# EAGLE design Esp32_Base_Shield (EAGLE 9.1.3)
ESP Devkit-C Shield
CNAME: ESP32-DEVKIT SHIELD DESIGN; CREVISION: 1.0; DESIGNER: EREN MERT IREZ
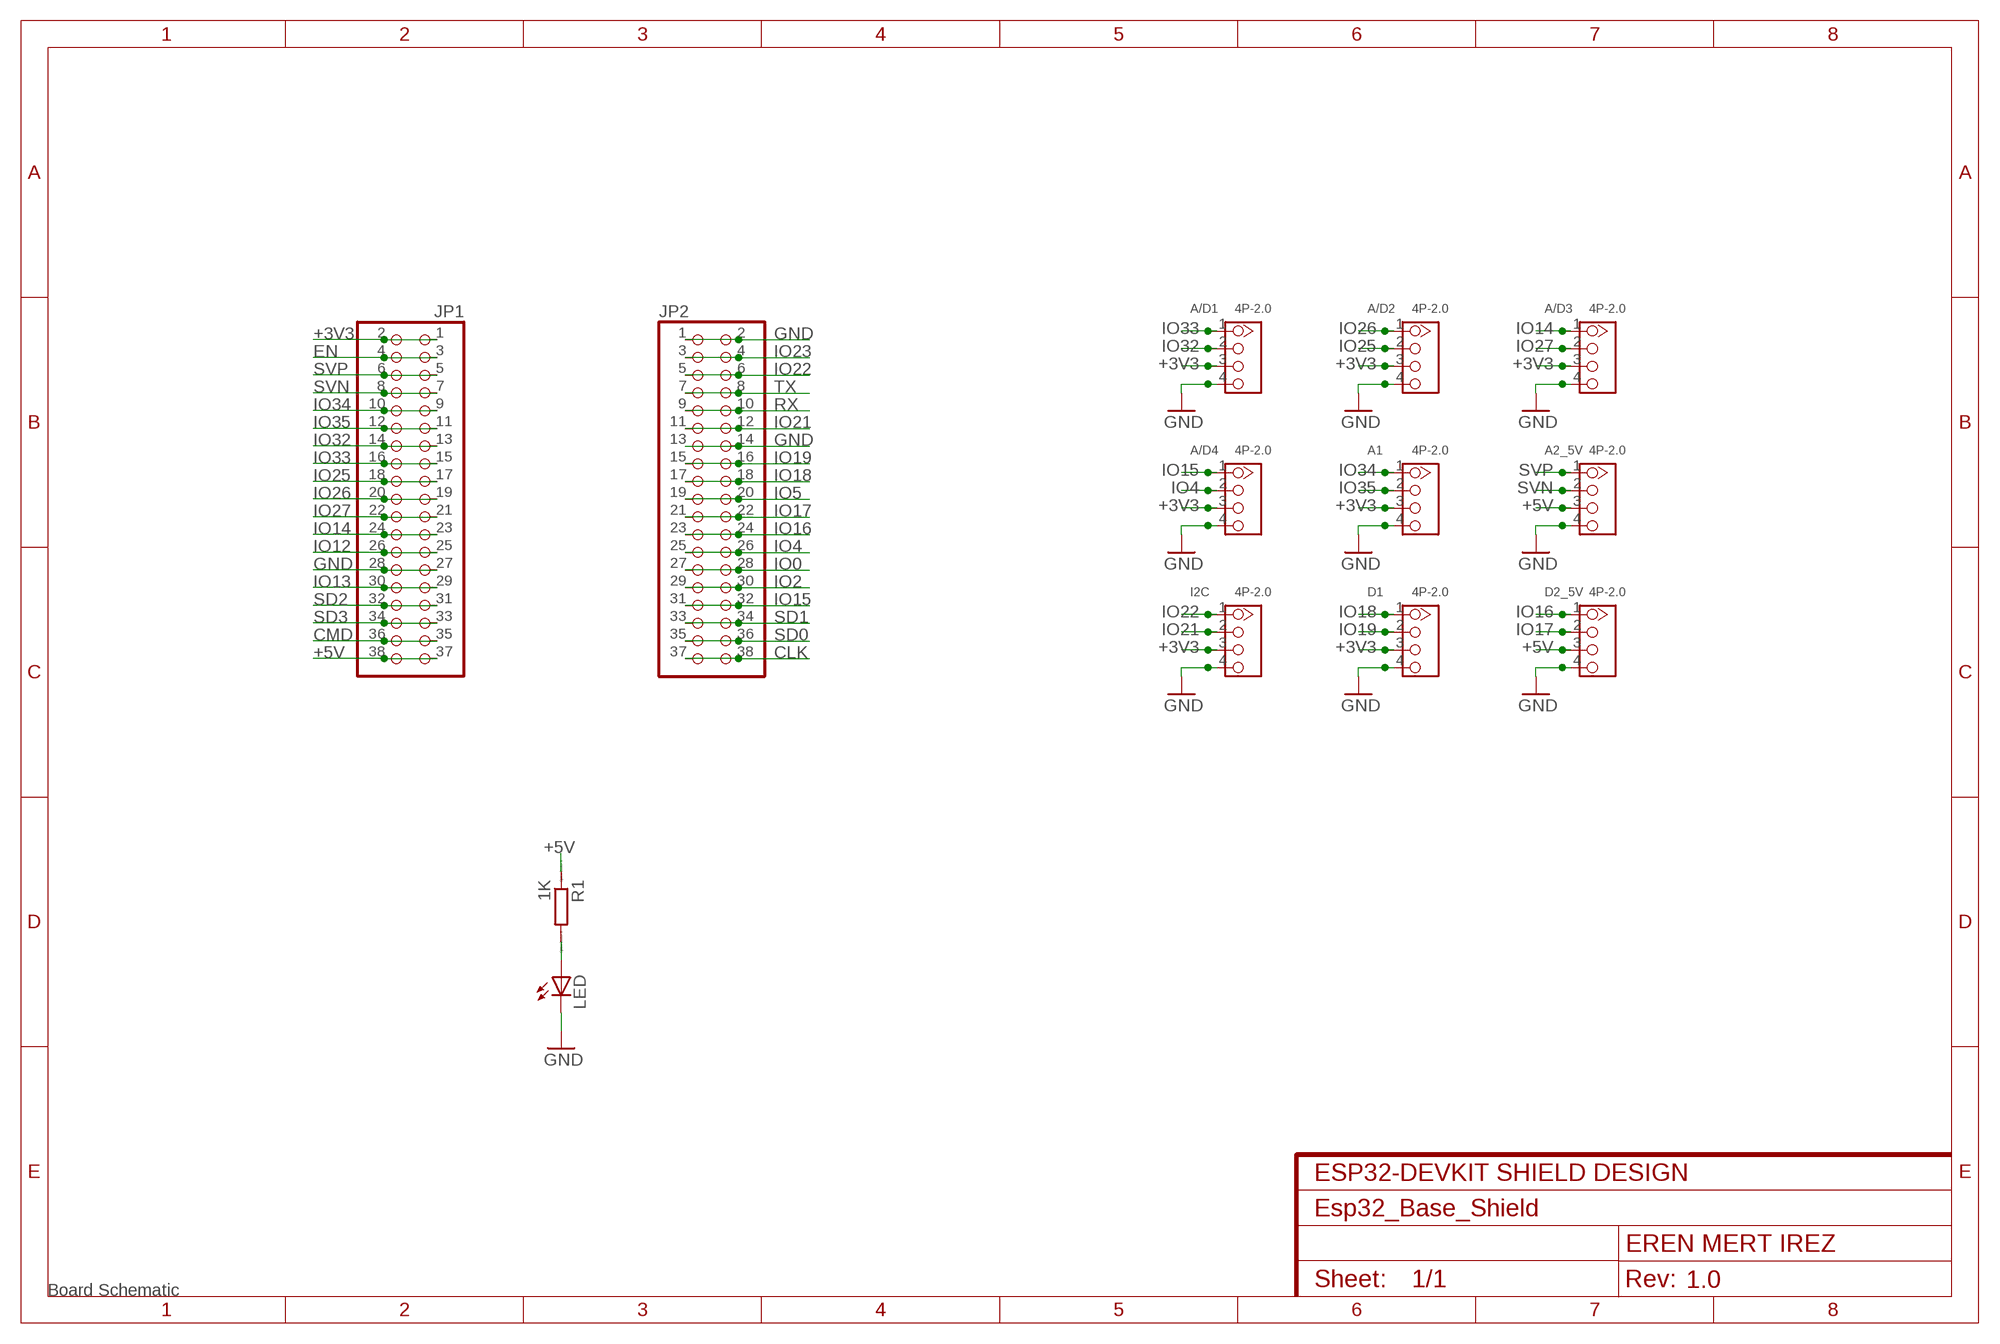
[diagram p0: schematic, sheet 1]
FRAME1 (FRAME-A4L): UNTITLED: Board Schematic

## Parts
A1  4P-2.0  GROVE-CONNECTOR-DIP(4P-2.0)  [HW4-2.0]
A2_5V  4P-2.0  GROVE-CONNECTOR-DIP(4P-2.0)  [HW4-2.0]
A/D1  4P-2.0  GROVE-CONNECTOR-DIP(4P-2.0)  [HW4-2.0]
A/D2  4P-2.0  GROVE-CONNECTOR-DIP(4P-2.0)  [HW4-2.0]
A/D3  4P-2.0  GROVE-CONNECTOR-DIP(4P-2.0)  [HW4-2.0]
A/D4  4P-2.0  GROVE-CONNECTOR-DIP(4P-2.0)  [HW4-2.0]
D1  4P-2.0  GROVE-CONNECTOR-DIP(4P-2.0)  [HW4-2.0]
D2_5V  4P-2.0  GROVE-CONNECTOR-DIP(4P-2.0)  [HW4-2.0]
I2C  4P-2.0  GROVE-CONNECTOR-DIP(4P-2.0)  [HW4-2.0]
JP1  PINHD-2X19  [2X19]
JP2  PINHD-2X19  [2X19]
LED  LED3MM  [LED3MM]
R1  1K  R0207/10  [0207/10]

## Nets
+3V3: A1.3 A/D1.3 A/D2.3 A/D3.3 A/D4.3 D1.3 I2C.3 JP1.1 JP1.2
+5V: A2_5V.3 D2_5V.3 JP1.37 JP1.38 R1.1
CLK: JP2.37 JP2.38
CMD: JP1.35 JP1.36
CRC: LED.A R1.2
EN: JP1.3 JP1.4
GND: A1.4 A2_5V.4 A/D1.4 A/D2.4 A/D3.4 A/D4.4 D1.4 D2_5V.4 I2C.4 JP1.27 JP1.28 JP2.1 JP2.2 JP2.13 JP2.14 LED.K(C)
IO0: JP2.27 JP2.28
IO2: JP2.29 JP2.30
IO4: A/D4.2 JP2.25 JP2.26
IO5: JP2.19 JP2.20
IO12: JP1.25 JP1.26
IO13: JP1.29 JP1.30
IO14: A/D3.1 JP1.23 JP1.24
IO15: A/D4.1 JP2.31 JP2.32
IO16: D2_5V.1 JP2.23 JP2.24
IO17: D2_5V.2 JP2.21 JP2.22
IO18: D1.1 JP2.17 JP2.18
IO19: D1.2 JP2.15 JP2.16
IO21: I2C.2 JP2.11 JP2.12
IO22: I2C.1 JP2.5 JP2.6
IO23: JP2.3 JP2.4
IO25: A/D2.2 JP1.17 JP1.18
IO26: A/D2.1 JP1.19 JP1.20
IO27: A/D3.2 JP1.21 JP1.22
IO32: A/D1.2 JP1.13 JP1.14
IO33: A/D1.1 JP1.15 JP1.16
IO34: A1.1 JP1.9 JP1.10
IO35: A1.2 JP1.11 JP1.12
RX: JP2.9 JP2.10
SD0: JP2.35 JP2.36
SD1: JP2.33 JP2.34
SD2: JP1.31 JP1.32
SD3: JP1.33 JP1.34
SVN: A2_5V.2 JP1.7 JP1.8
SVP: A2_5V.1 JP1.5 JP1.6
TX: JP2.7 JP2.8

## Library data of the parts
A1 A2_5V A/D1-A/D4 D1 D2_5V I2C = Seeed-Connector -2016:GROVE-CONNECTOR-DIP(4P-2.0): 320110033
JP1 JP2 = pinhead:PINHD-2X19: PIN HEADER
LED = led:LED: LED OSRAM: - CHIPLED LG R971, LG N971, LY N971, LG Q971, LY Q971, LO R971, LY R971 LH N974, LH R974 LS Q976, LO Q976, LY Q976 LO Q996 - Hyper CHIPLED LW Q18S LB Q993, LB Q99A, LB R99A - SideLED LS A670, LO A670, LY A670, LG A670, LP A670 LB A673, LV A673, LT A673, LW A673 LH A674 LY A675 LS A676, LA A676, LO A676, LY A676, LW A676 LS A679, LY A679, LG A679 - Hyper Micro SIDELED® LS Y876, LA Y876, LO Y876, LY Y876 LT Y87S - SmartLED LW L88C, LW L88S LB L89C, LB L89S, LG L890 LS L89K, LO L89K, LY L89K LS L896, LA L896, LO L896, LY L896 - TOPLED LS T670, LO T670, LY T670, LG T670, LP T670 LSG T670, LSP T670, LSY T670, LOP T670, LYG T670 LG T671, LOG T671, LSG T671 LB T673, LV T673, LT T673, LW T673 LH T674 LS T676, LA T676, LO T676, LY T676, LB T676, LH T676, LSB T676, LW T676 LB T67C, LV T67C, LT T67C, LS T67K, LO T67K, LY T67K, LW E67C LS E67B, LA E67B, LO E67B, LY E67B, LB E67C, LV E67C, LT E67C LW T67C LS T679, LY T679, LG T679 LS T770, LO T770, LY T770, LG T770, LP T770 LB T773, LV T773, LT T773, LW T773 LH T774 LS E675, LA E675, LY E675, LS T675 LS T776, LA T776, LO T776, LY T776, LB T776 LHGB T686 LT T68C, LB T68C - Hyper Mini TOPLED® LB M676 - Mini TOPLED Santana® LG M470 LS M47K, LO M47K, LY M47K Source: http://www.osram.convergy.de LUXEON: - LUMILED® LXK2-PW12-R00, LXK2-PW12-S00, LXK2-PW14-U00, LXK2-PW14-V00 LXK2-PM12-R00, LXK2-PM12-S00, LXK2-PM14-U00 LXK2-PE12-Q00, LXK2-PE12-R00, LXK2-PE12-S00, LXK2-PE14-T00, LXK2-PE14-U00 LXK2-PB12-K00, LXK2-PB12-L00, LXK2-PB12-M00, LXK2-PB14-N00, LXK2-PB14-P00, LXK2-PB14-Q00 LXK2-PR12-L00, LXK2-PR12-M00, LXK2-PR14-Q00, LXK2-PR14-R00 LXK2-PD12-Q00, LXK2-PD12-R00, LXK2-PD12-S00 LXK2-PH12-R00, LXK2-PH12-S00 LXK2-PL12-P00, LXK2-PL12-Q00, LXK2-PL12-R00 Source: www.luxeon.com KINGBRIGHT: KA-3528ASYC Source: www.kingbright.com
R1 = eagle-ltspice:R: RESISTOR, European symbol; SPICEMODEL: NONE; SPICEPREFIX: R

## Board
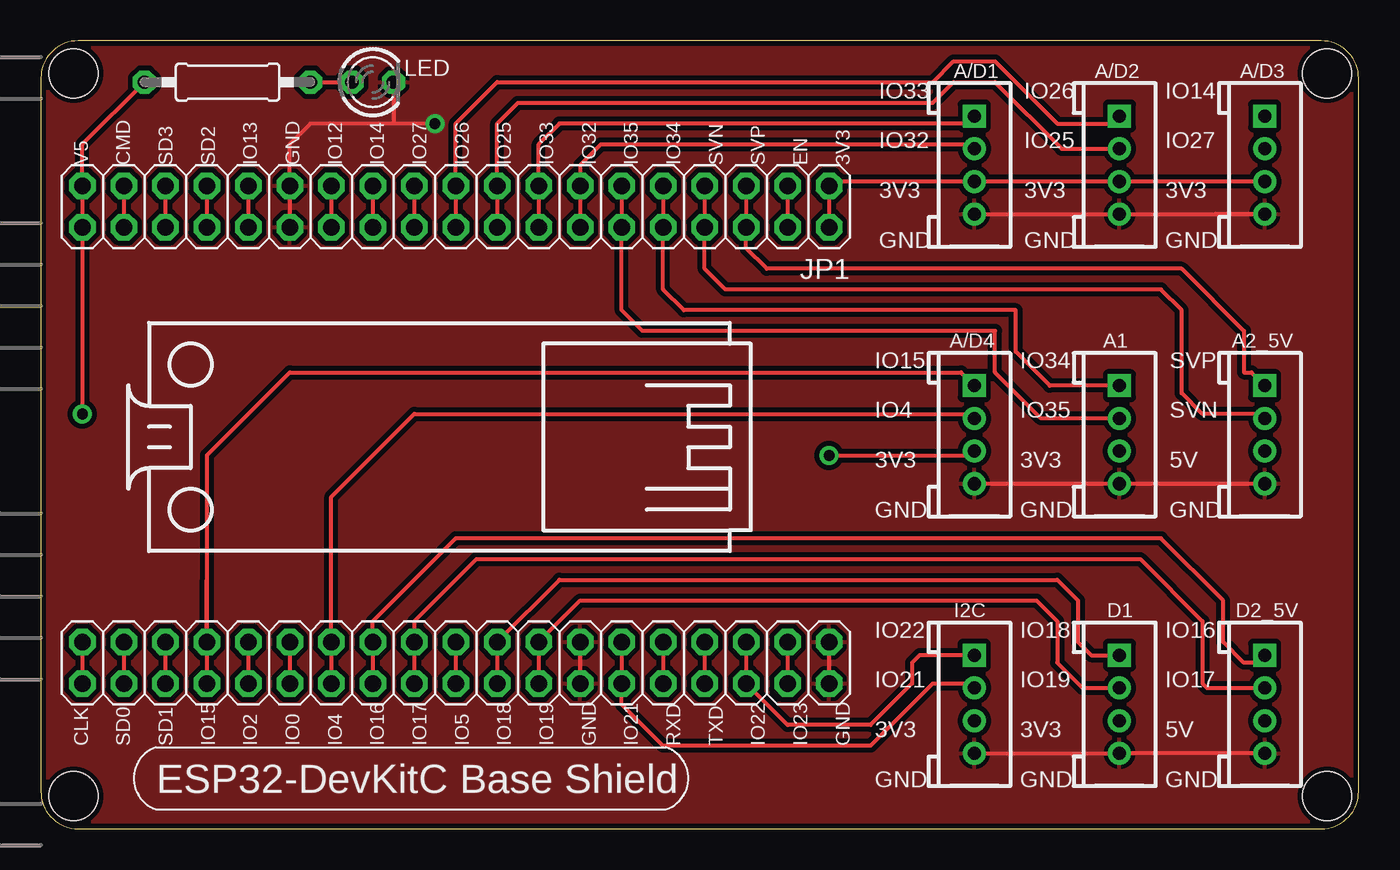
[diagram p1: board, top side]
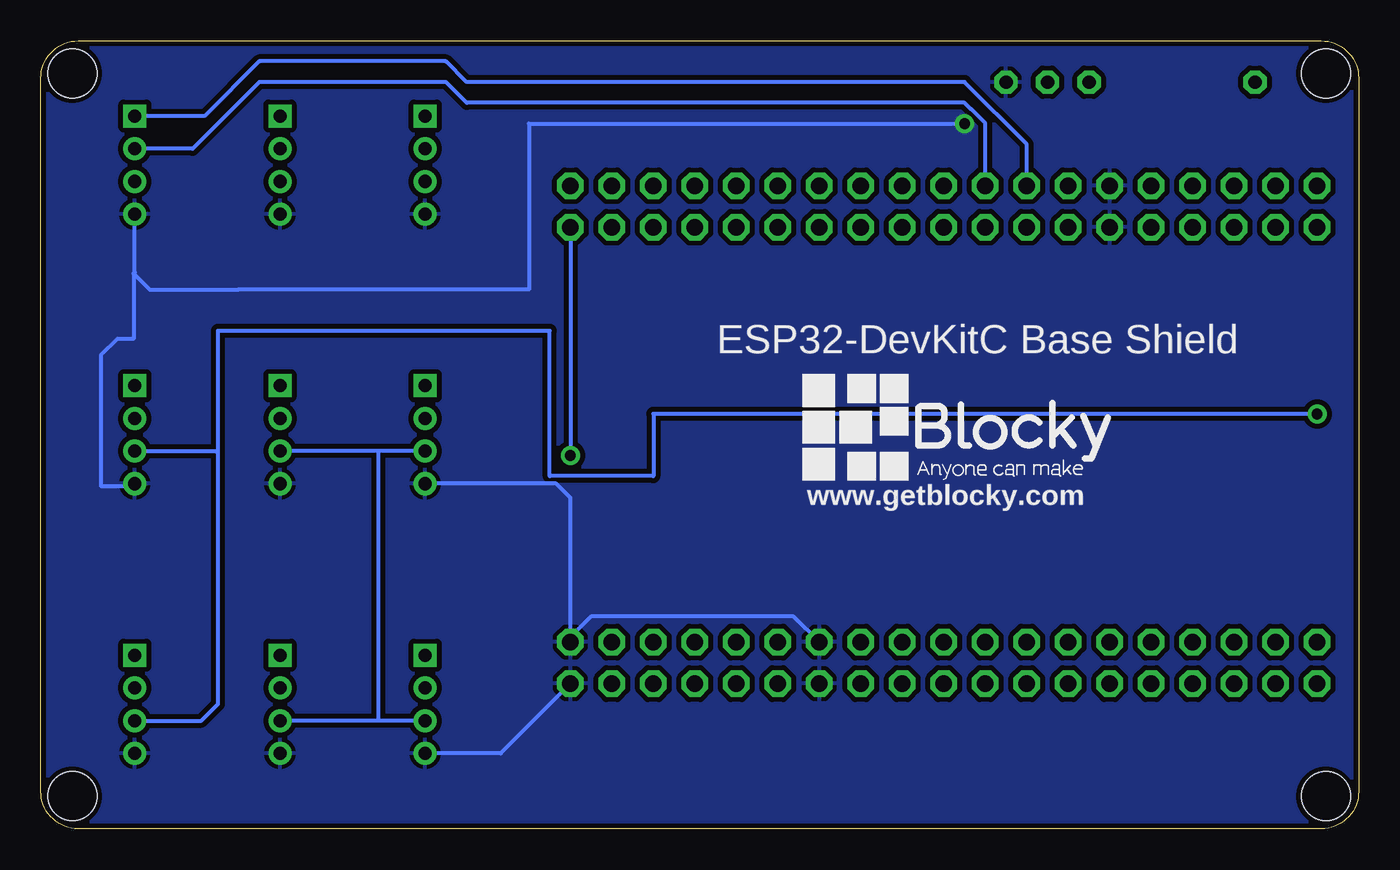
[diagram p2: board, bottom side, seen from below]

Size 80.68 x 48.25 mm. Coordinates in mm from the lower left corner, seen from the top.
Outline: 2.29,0 78.39,0 arc90 80.68,2.29 80.68,45.96 arc90 78.39,48.25 2.29,48.25 arc90 0,45.96 0,2.29 arc90 2.29,0
Copper layers (1*16): Top 0.035mm / dielectric 1.5mm / Bottom 0.035mm
Design rules "SparkFun": minimum track width 8mil, minimum drill 20mil, track to track 8mil, track to pad 8mil, pad to pad 8mil, via to via 8mil, smd to smd 8mil, copper to edge 8mil, drill to drill 8mil, minimum pad ring 12mil, minimum via ring 10mil, stop-mask expansion 4mil, vias tented up to drill 20mil, thermal gap 10mil
Holes 3 mm at 2,46.25 78.75,46.25 78.75,2 2,2

### Footprints (pad centres in the part's own frame; a part is rotated, then mirrored left to right if it is on the bottom)
HW4-2.0 = drill 0.8 pad 1.27 square: 1 -3,0 | drill 0.8 pad 1.27: 2 -1,0; 3 1,0; 4 3,0
2X19 = drill 1.016 octagon: 1 -22.86,-1.27; 2 -22.86,1.27; 3 -20.32,-1.27; 4 -20.32,1.27; 5 -17.78,-1.27; 6 -17.78,1.27; 7 -15.24,-1.27; 8 -15.24,1.27; 9 -12.7,-1.27; 10 -12.7,1.27; 11 -10.16,-1.27; 12 -10.16,1.27; 13 -7.62,-1.27; 14 -7.62,1.27; 15 -5.08,-1.27; 16 -5.08,1.27; 17 -2.54,-1.27; 18 -2.54,1.27; 19 0,-1.27; 20 0,1.27; 21 2.54,-1.27; 22 2.54,1.27; 23 5.08,-1.27; 24 5.08,1.27; 25 7.62,-1.27; 26 7.62,1.27; 27 10.16,-1.27; 28 10.16,1.27; 29 12.7,-1.27; 30 12.7,1.27; 31 15.24,-1.27; 32 15.24,1.27; 33 17.78,-1.27; 34 17.78,1.27; 35 20.32,-1.27; 36 20.32,1.27; 37 22.86,-1.27; 38 22.86,1.27
LED3MM = drill 0.813 octagon: A -1.27,0; K 1.27,0
0207/10 = drill 0.813 octagon: 1 -5.08,0; 2 5.08,0

### Placement (x,y rotation side)
A1  66.04,24.13 270 top
A2_5V  74.93,24.13 270 top
A/D1  57.15,40.64 270 top
A/D2  66.04,40.64 270 top
A/D3  74.93,40.64 270 top
A/D4  57.15,24.13 270 top
D1  66.04,7.62 270 top
D2_5V  74.93,7.62 270 top
I2C  57.15,7.62 270 top
JP1  25.4,38.1 180 top
JP2  25.4,10.16 180 top
LED  20.32,45.72 0 top
R1  11.43,45.72 0 top
U$1  [BLOCKY_LOGO]  35.05,21.08 0 bottom
U$5  [BREADBOARD_SPACING]  -1.27,23.13 90 top

### Tracks (layer width: path | path; a pad name or v marks a point on that pad's centre or on a via)
+3V3  (via drill 0.65)
  Top 0.254: JP1.2 JP1.1 48.53,39.64 A/D1.3 A/D2.3 A/D3.3 | v48.26,22.86 56.88,22.86 A/D4.3
  Bottom 0.254: JP1.2 v48.26,22.86 | I2C.3 60,6.62 | 60,6.62 D1.3 | A/D4.3 60,23.13 | 60,23.13 A1.3 | 60,6.62 60,23.13
+5V  (via drill 0.65)
  Top 0.254: v2.54,25.4 JP1.38 JP1.37 2.54,41.91 R1.1
  Bottom 0.254: 69.85,23 69.85,30.48 49.53,30.48 49.53,21.59 43.18,21.59 43.18,25.4 v2.54,25.4 | 69.85,23 69.85,7.62 70.85,6.62 D2_5V.3 | A2_5V.3 69.98,23.13 69.85,23
CLK
  Top 0.254: JP2.37 JP2.38
CMD
  Top 0.254: JP1.35 JP1.36
CRC
  Top 0.254: R1.2 LED.A
EN
  Top 0.254: JP1.3 JP1.4
GND  (via drill 0.65)
  Top 0.254: JP1.28 JP1.27 15.24,41.91 16.51,43.18 21.59,43.18 | JP2.13 JP2.14 | JP2.1 JP2.2 | v24.13,43.18 21.59,43.18 | A/D1.4 A/D2.4 A/D3.4 71.93,37.64 | A/D4.4 A1.4 A2_5V.4 | D2_5V.4 D1.4 I2C.4 | LED.K 21.59,43.18
  Bottom 0.254: v24.13,43.18 50.8,43.18 50.8,33.02 68.58,33.02 68.6,33 74,33 75,34 | 75,34 74.93,34.07 A/D3.4 | 75,34 75,30 76,30 77,29 77,21 75.06,21 A2_5V.4 | JP2.2 52.53,4.62 I2C.4 | JP2.13 34.59,13 47,13 48.26,11.74 JP2.1 48.26,20.26 49.13,21.13 A/D4.4
  pour Top (isolate 0.305): 0,48.26 0,0 81.01,0 81.01,48.26
  pour Bottom (isolate 0.305): 0,48.26 0,0 81.01,0 81.01,48.26
IO0
  Top 0.254: JP2.27 JP2.28
IO2
  Top 0.254: JP2.29 JP2.30
IO4
  Top 0.254: JP2.26 JP2.25 17.78,20.32 22.86,25.4 56.88,25.4 A/D4.2
IO5
  Top 0.254: JP2.19 JP2.20
IO12
  Top 0.254: JP1.25 JP1.26
IO13
  Top 0.254: JP1.29 JP1.30
IO14
  Top 0.254: JP1.23 JP1.24
  Bottom 0.254: A/D3.1 70.66,43.64 67.31,46.99 55.88,46.99 54.61,45.72 24.13,45.72 20.32,41.91 JP1.23
IO15
  Top 0.254: JP2.31 10.16,15.24 | JP2.31 JP2.32 | JP2.31 10.16,22.86 15.24,27.94 56.34,27.94 A/D4.1
IO16
  Top 0.254: JP2.24 JP2.23 20.32,12.7 25.4,17.78 68.58,17.78 72.39,13.97 72.39,11.43 73.66,10.16 74.47,10.16 D2_5V.1
IO17
  Top 0.254: JP2.22 JP2.21 22.86,12.7 26.67,16.51 67.31,16.51 71.12,12.7 71.12,8.89 71.39,8.62 D2_5V.2
IO18
  Top 0.254: JP2.18 JP2.17 31.75,15.24 62.23,15.24 63.5,13.97 63.5,11.43 64.31,10.62 D1.1
IO19
  Top 0.254: JP2.16 JP2.15 33.02,13.97 60.96,13.97 62.23,12.7 62.23,10.16 63.77,8.62 D1.2
IO21
  Top 0.254: JP2.11 JP2.12 35.56,7.62 38.1,5.08 50.8,5.08 54.61,8.89 56.88,8.89 I2C.2
IO22
  Top 0.254: JP2.5 JP2.6 45.72,6.35 50.8,6.35 53.34,8.89 53.34,10.16 53.8,10.62 I2C.1
IO23
  Top 0.254: JP2.3 JP2.4
IO25
  Top 0.254: JP1.18 JP1.17 27.94,43.18 29.21,44.45 54.61,44.45 55.88,45.72 58.42,45.72 62.5,41.64 A/D2.2
IO26
  Top 0.254: JP1.20 JP1.19 25.4,43.18 27.94,45.72 54.61,45.72 55.88,46.99 58.42,46.99 62.23,43.18 65.58,43.18 A/D2.1
IO27
  Top 0.254: JP1.21 JP1.22
  Bottom 0.254: JP1.21 22.86,43.2 23.75,44.09 23.77,44.09 24.13,44.45 54.61,44.45 55.88,45.72 67.31,45.72 71.39,41.64 A/D3.2
IO32
  Top 0.254: JP1.14 JP1.13 33.02,40.64 34.29,41.91 56.88,41.91 A/D1.2
IO33
  Top 0.254: JP1.16 JP1.15 30.48,41.91 31.75,43.18 56.69,43.18 A/D1.1
IO34
  Top 0.254: JP1.9 JP1.10 38.1,33.02 39.37,31.75 59.69,31.75 59.69,29.21 61.77,27.13 A1.1
IO35
  Top 0.254: JP1.11 JP1.12 35.56,31.75 36.83,30.48 58.42,30.48 58.42,27.94 61.23,25.13 A1.2
RX
  Top 0.254: JP2.9 JP2.10
SD0
  Top 0.254: JP2.35 JP2.36
SD1
  Top 0.254: JP2.33 JP2.34
SD2
  Top 0.254: JP1.31 JP1.32
SD3
  Top 0.254: JP1.33 JP1.34
SVN
  Top 0.254: JP1.7 JP1.8 40.64,34.29 41.91,33.02 68.58,33.02 69.85,31.75 69.85,26.67 71.12,25.4 74.66,25.4 A2_5V.2
SVP
  Top 0.254: JP1.5 JP1.6 43.18,35.56 44.45,34.29 69.85,34.29 73.66,30.48 73.66,27.94 74.12,27.94 A2_5V.1
TX
  Top 0.254: JP2.7 JP2.8

### Text on the board
tPlace: V5 / CMD / SD3 / SD2 / IO13 / GND / IO12 / IO14 / IO27 / IO26 / IO25 / IO33 / IO32 / IO35 / IO34 / SVN / SVP / EN / 3V3 | IO33 / / IO32 / / 3V3 / / GND | IO26 / / IO25 / / 3V3 / / GND | IO14 / / IO27 / / 3V3 / / GND | IO15 / / IO4 / / 3V3 / / GND | IO34 / / IO35 / / 3V3 / / GND | SVP / / SVN / / 5V / / GND | CLK / SD0 / SD1 / IO15 / IO2 / IO0 / IO4 / IO16 / IO17 / IO5 / IO18 / IO19 / GND / IO21 / RXD / TXD / IO22 / IO23 / GND | IO22 / / IO21 / / 3V3 / / GND | IO18 / / IO19 / / 3V3 / / GND | IO16 / / IO17 / / 5V / / GND | ESP32-DevKitC Base Shield
bPlace: ESP32-DevKitC Base Shield